# Altium schematic sheet Sec_Controller_Sheet3.SchDoc
size 420 x 297 mm; SheetNumber: 22; SheetTotal: 32
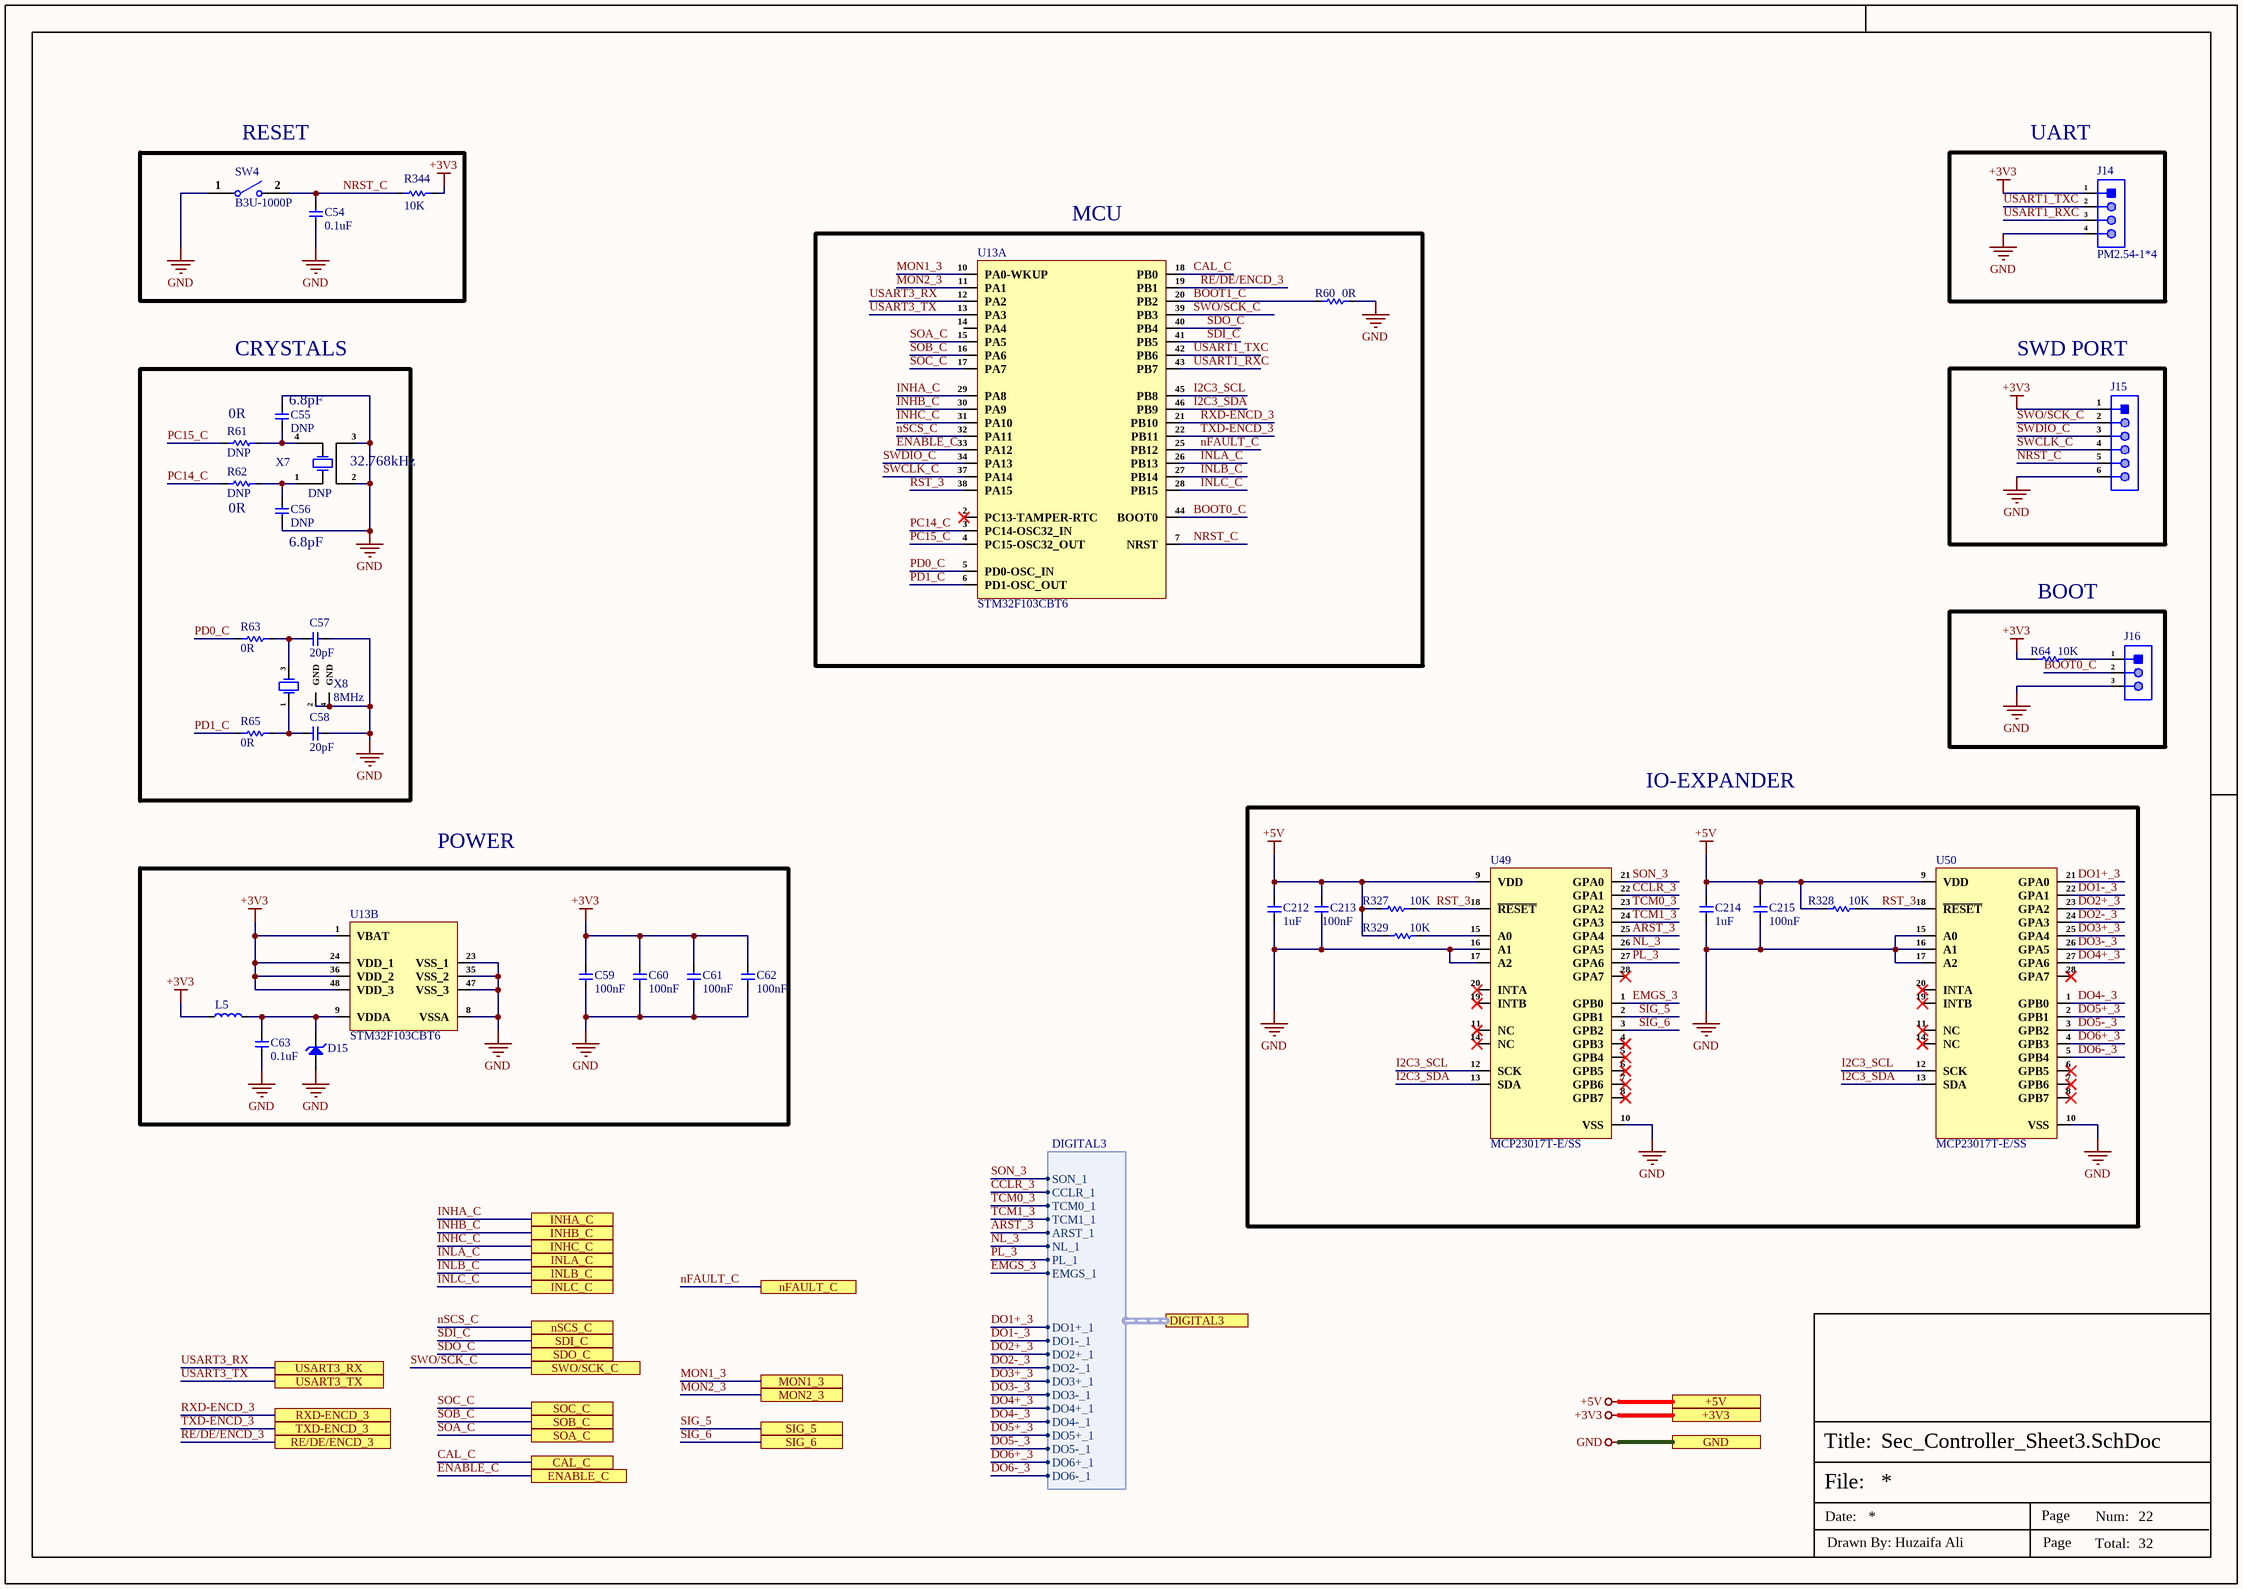
[diagram p0: Sec_Controller_Sheet3.SchDoc]

## Parts
C54  0.1uF  [Cap-0402]
C55  DNP  [Cap-0402]
C56  DNP  [Cap-0402]
C57  20pF  [Cap-0402]
C58  20pF  [Cap-0402]
C59  100nF  [cap-0402]
C60  100nF  [cap-0402]
C61  100nF  [cap-0402]
C62  100nF  [cap-0402]
C63  0.1uF  [Cap-0402]
C212  1uF  [Cap-0402]
C213  100nF  [cap-0402]
C214  1uF  [Cap-0402]
C215  100nF  [cap-0402]
D15  AZ3003-01G  [SOD-123]  (value not drawn)
J14  PM2.54-1*4  [HDR1X4 Female]
J15  X6511WV-06H-C60D30  [HDR1X6_]  (value not drawn)
J16  68000-103HLF  [HDR1X3_]  (value not drawn)
L5  BLM15AG601SN1D  [IND-0402]  (value not drawn)
R60  0R  [Res-0402]
R61  DNP  [Res-0603]
R62  DNP  [Res-0603]
R63  0R  [Res-0603]
R64  10K  [Res-0402]
R65  0R  [Res-0603]
R327  10K  [Res-0402]
R328  10K  [Res-0402]
R329  10K  [Res-0402]
R344  10K  [Res-0402]
SW4  B3U-1000P  [B3U-1000P]
U13  STM32F103CBT6  [48-LQFP (7x7)_]  (parts A,B of 2)
U49  MCP23017T-E/SS  [SSOP-28-208mil]
U50  MCP23017T-E/SS  [SSOP-28-208mil]
X7  DNP  [MC-306]
X8  8MHz  [5TJ480000XYLBC_]

## Blocks framed on the sheet
RESET: C54 R344 SW4
UART: J14
MCU: R60 U13
CRYSTALS: C55-C58 R61-R63 R65 X7 X8
SWD PORT: J15
BOOT: J16 R64
IO-EXPANDER: C212-C215 R327-R329 U49 U50
POWER: C59-C63 D15 L5 U13

## Ports
+3V3 (see Servo3[2A], CAN_Sheet[5D], Connector_Sheet[5D], Controller_Sheet[5D], Encoder_Sheet1[5D], Encoder_Sheet2[5D], Encoder_Sheet3[5D], Encoder_Sheet4[5D], EtherCAT_Sheet[5D], Motor_Driver_Sheet1[5D], Motor_Driver_Sheet2[5D], Motor_Driver_Sheet3[5D], Motor_Driver_Sheet4[5D], Power_Sheet[5D], RJ45_Sheet[5D], RS485_RS232_Sheet[3D], Sec_Controller_Sheet1[5D], Sec_Controller_Sheet2[5D], Sec_Controller_Sheet4[5D]), +5V, CAL_C (see Servo3[2B], Motor_Driver_Sheet3[3D]), DIGITAL3 (harness DIGITAL3, see Servo3[2B], DIO_3[4D]), ENABLE_C (see Servo3[2B], Motor_Driver_Sheet3[3D]), GND (see Servo3[2B], CAN_Sheet[5D], Connector_Sheet[5D], Controller_Sheet[5D], DIO_1[5D], DIO_2[5D], DIO_3[5D], DIO_4[5D], Encoder_Sheet1[5D], Encoder_Sheet2[5D], Encoder_Sheet3[5D], Encoder_Sheet4[5D], EtherCAT_Sheet[5D], MOSFET_Driver_Sheet1[5D], MOSFET_Driver_Sheet2[5D], MOSFET_Driver_Sheet3[5D], MOSFET_Driver_Sheet4[5D], Motor_Driver_Sheet1[5D], Motor_Driver_Sheet2[5D], Motor_Driver_Sheet3[5D], Motor_Driver_Sheet4[5D], Power_Sheet[5D], RJ45_Sheet[5D], RS485_RS232_Sheet[3D], Sec_Controller_Sheet1[5D], Sec_Controller_Sheet2[5D], Sec_Controller_Sheet4[5D]), INHA_C (see Servo3[2B], Motor_Driver_Sheet3[3D]), INHB_C (see Servo3[2B], Motor_Driver_Sheet3[3D]), INHC_C (see Servo3[2B], Motor_Driver_Sheet3[3D]), INLA_C (see Servo3[2B], Motor_Driver_Sheet3[3D]), INLB_C (see Servo3[2B], Motor_Driver_Sheet3[3D]), INLC_C (see Servo3[2B], Motor_Driver_Sheet3[3D]), MON1_3 (see Servo3[2B], DIO_3[3D]), MON2_3 (see Servo3[2B], DIO_3[3D]), nFAULT_C (see Servo3[2B], Motor_Driver_Sheet3[3D]), nSCS_C (see Servo3[2B], Motor_Driver_Sheet3[3D]), RE/DE/ENCD_3 (see Servo3[2B], Encoder_Sheet3[3D]), RXD-ENCD_3 (see Servo3[2B], Encoder_Sheet3[3D]), SDI_C (see Servo3[2B], Motor_Driver_Sheet3[3D]), SDO_C (see Servo3[2B], Motor_Driver_Sheet3[3D]), SIG_5 (see Servo3[2B], DIO_3[2D]), SIG_6 (see Servo3[2B], DIO_3[2D]), SOA_C (see Servo3[2B], Motor_Driver_Sheet3[3D]), SOB_C (see Servo3[2B], Motor_Driver_Sheet3[3D]), SOC_C (see Servo3[2B], Motor_Driver_Sheet3[3D]), SWO/SCK_C (see Servo3[2B], Motor_Driver_Sheet3[3D]), TXD-ENCD_3 (see Servo3[2B], Encoder_Sheet3[3D]), USART3_RX (see Servo3[2B], Controller_Sheet[2D], Servo3[1B]), USART3_TX (see Servo3[2B], Controller_Sheet[2D], Servo3[1B])

## Harnesses
DIGITAL3: SON_1, TCM0_1, CCLR_1, TCM1_1, ARST_1, NL_1, PL_1, EMGS_1, DO1+_1, DO1-_1, DO2+_1, DO2-_1, DO3+_1, DO3-_1, DO4+_1, DO4-_1, DO5+_1, DO5-_1, DO6+_1, DO6-_1

## Nets
+3V3: C59.2 C60.2 C61.2 C62.2 J14.1 J15.1 L5.1 R64.2 R344.2 U13.1(VBAT) U13.24(VDD_1) U13.36(VDD_2) U13.48(VDD_3) ; port +3V3
+5V: C212.2 C213.2 C214.2 C215.2 R327.2 R328.2 R329.2 U49.9(VDD) U50.9(VDD) ; port +5V
GND: C54.1 C55.2 C56.1 C57.2 C58.2 C59.1 C60.1 C61.1 C62.1 C63.1 C212.1 C213.1 C214.1 C215.1 D15.1(A) J14.4 J15.6 J16.3 R60.2 SW4.1 U13.8(VSSA) U13.23(VSS_1) U13.35(VSS_2) U13.47(VSS_3) U49.10(VSS) U49.16(A1) U49.17(A2) U50.10(VSS) U50.15(A0) U50.16(A1) U50.17(A2) X7.2 X7.3 X8.2(GND) X8.4(GND) ; port GND
ARST_3: U49.25(GPA4) ; port DIGITAL3.ARST_1
BOOT0_C: J16.2 U13.44(BOOT0)
BOOT1_C: R60.1 U13.20(PB2)
CAL_C: U13.18(PB0) ; port CAL_C
CCLR_3: U49.22(GPA1) ; port DIGITAL3.CCLR_1
DO1+_3: U50.21(GPA0) ; port DIGITAL3.DO1+_1
DO1-_3: U50.22(GPA1) ; port DIGITAL3.DO1-_1
DO2+_3: U50.23(GPA2) ; port DIGITAL3.DO2+_1
DO2-_3: U50.24(GPA3) ; port DIGITAL3.DO2-_1
DO3+_3: U50.25(GPA4) ; port DIGITAL3.DO3+_1
DO3-_3: U50.26(GPA5) ; port DIGITAL3.DO3-_1
DO4+_3: U50.27(GPA6) ; port DIGITAL3.DO4+_1
DO4-_3: U50.1(GPB0) ; port DIGITAL3.DO4-_1
DO5+_3: U50.2(GPB1) ; port DIGITAL3.DO5+_1
DO5-_3: U50.3(GPB2) ; port DIGITAL3.DO5-_1
DO6+_3: U50.4(GPB3) ; port DIGITAL3.DO6+_1
DO6-_3: U50.5(GPB4) ; port DIGITAL3.DO6-_1
EMGS_3: U49.1(GPB0) ; port DIGITAL3.EMGS_1
ENABLE_C: U13.33(PA12) ; port ENABLE_C
I2C3_SCL: U13.45(PB8) U49.12(SCK) U50.12(SCK)
I2C3_SDA: U13.46(PB9) U49.13(SDA) U50.13(SDA)
INHA_C: U13.29(PA8) ; port INHA_C
INHB_C: U13.30(PA9) ; port INHB_C
INHC_C: U13.31(PA10) ; port INHC_C
INLA_C: U13.26(PB13) ; port INLA_C
INLB_C: U13.27(PB14) ; port INLB_C
INLC_C: U13.28(PB15) ; port INLC_C
MON1_3: U13.10(PA0-WKUP) ; port MON1_3
MON2_3: U13.11(PA1) ; port MON2_3
nFAULT_C: U13.25(PB12) ; port nFAULT_C
NL_3: U49.26(GPA5) ; port DIGITAL3.NL_1
NRST_C: C54.2 J15.5 R344.1 SW4.2 U13.7(NRST)
nSCS_C: U13.32(PA11) ; port nSCS_C
PC14_C: R62.2 U13.3(PC14-OSC32_IN)
PC15_C: R61.2 U13.4(PC15-OSC32_OUT)
PD0_C: R63.2 U13.5(PD0-OSC_IN)
PD1_C: R65.2 U13.6(PD1-OSC_OUT)
PL_3: U49.27(GPA6) ; port DIGITAL3.PL_1
RE/DE/ENCD_3: U13.19(PB1) ; port RE/DE/ENCD_3
RST_3: R327.1 R328.1 U13.38(PA15) U49.18(~{RESET}) U50.18(~{RESET})
RXD-ENCD_3: U13.21(PB10) ; port RXD-ENCD_3
SDI_C: U13.41(PB5) ; port SDI_C
SDO_C: U13.40(PB4) ; port SDO_C
SIG_5: U49.2(GPB1) ; port SIG_5
SIG_6: U49.3(GPB2) ; port SIG_6
SOA_C: U13.15(PA5) ; port SOA_C
SOB_C: U13.16(PA6) ; port SOB_C
SOC_C: U13.17(PA7) ; port SOC_C
SON_3: U49.21(GPA0) ; port DIGITAL3.SON_1
SWCLK_C: J15.4 U13.37(PA14)
SWDIO_C: J15.3 U13.34(PA13)
SWO/SCK_C: J15.2 U13.39(PB3) ; port SWO/SCK_C
TCM0_3: U49.23(GPA2) ; port DIGITAL3.TCM0_1
TCM1_3: U49.24(GPA3) ; port DIGITAL3.TCM1_1
TXD-ENCD_3: U13.22(PB11) ; port TXD-ENCD_3
USART1_RXC: J14.3 U13.43(PB7)
USART1_TXC: J14.2 U13.42(PB6)
USART3_RX: U13.12(PA2) ; port USART3_RX
USART3_TX: U13.13(PA3) ; port USART3_TX
NetC55_1: C55.1 R61.1 X7.4(OSC2)
NetC56_2: C56.2 R62.1 X7.1(OSC1)
NetC57_1: C57.1 R63.1 X8.3(OSC2)
NetC58_1: C58.1 R65.1 X8.1(OSC1)
NetC63_2: C63.2 D15.2(K) L5.2 U13.9(VDDA)
NetJ16_1: J16.1 R64.1
NetR329_1: R329.1 U49.15(A0)

Not connected (* = marked no-connect by the designer): U13 2(PC13-TAMPER-RTC)* 14(PA4); U49 4(GPB3)* 5(GPB4)* 6(GPB5)* 7(GPB6)* 8(GPB7)* 11(NC)* 14(NC)* 19(INTB)* 20(INTA)* 28(GPA7)*; U50 6(GPB5)* 7(GPB6)* 8(GPB7)* 11(NC)* 14(NC)* 19(INTB)* 20(INTA)* 28(GPA7)*

## Notes on the sheet
- (near R61) 0R
- (near C55) 6.8pF
- (near R62) 0R
- (near X7) 32.768kHz
- (near C56) 6.8pF
- File:
- Title:
- Date:
- Page
- Num:
- Total:
- Drawn By: Huzaifa Ali

## Library data of the parts
C54 C63 = CC0402JRX7R7BB104: CAP CER 0.1UF 16V X7R 0402; Manufacturer: Yageo; Material: 4241ConductorMaterial; Value: 100nF; Tolerance: 5%; Item Type: Capacitor; Supplier: Digikey; Supplier Part Number: 311-1676-1-ND; Manufacturer Part Number: CC0402JRX7R7BB104; RoHS: Yes; Category: Ceramic Capacitors; Stock: 1659111; Pricing: 1=0.1, 10=0.046, 50=0.0262, 100=0.0203, 500=0.01528, 1000=0.012, 2500=0.01091, 5000=0.01004 (USD); Mounting Technology: Surface Mount; Case/Package: 0402; Case Code (Metric): 1005; Case Code (Imperial): 0402; Min Operating Temperature: -55°C; Max Operating Temperature: 125°C; Dielectric: X7R; Packaging: Tape and Reel; Package Quantity: 10000; Voltage Rating (DC): 16V; Voltage Rating: 16V; Series: CC; Construction: Flat; Length: 0.039inch; Width: 0.02inch; Height: 0.5mm; Thickness: 0.022inch; Lead Free: Lead Free; Halogen Free: Halogen Free; RoHS Compliant: Yes; ComponentLink1URL: https://datasheet.ciiva.com/13210/upy-gphc-x7r-6-3v-to-50v-8-12304-13210152.pdf?src-supplier=Mouser; ComponentLink1Description: https://datasheet.ciiva.com/13210/upy-gphc-x7r-6-3v-to-50v-8-12304-13210152.pdf?src-supplier=Mouser; LCSC Part Number: C541464
C55 C56 = CC0402CRNPO9BN6R8: CAP CER 6.8PF 50V C0G/NPO 0402; Manufacturer: Yageo; Dielectric: C0G; Tolerance: 2%; Insulation Resistance: 10GR; Item Type: Capacitor; Supplier: Future Electronics; Supplier Part Number: 3247368; Manufacturer Part Number: CC0402CRNPO9BN6R8; RoHS: Yes; Category: Ceramic Capacitors; Stock: 200000; Pricing: 10000=0.0024, 40000=0.0022, 150000=0.0021, 400000=0.002, 1000000=0.0019 (USD); Mounting Technology: Surface Mount; Case/Package: 0402; Case Code (Imperial): 0402; Case Code (Metric): 1005; Weight: 2.3E-05oz; Min Operating Temperature: -55°C; Max Operating Temperature: 125°C; Value: 6.8pF; Packaging: Tape and Reel; Voltage Rating: 50V; Voltage Rating (DC): 50V; Termination: SMD/SMT; Series: CC; Construction: Flat; Length: 1mm; Width: 0.5mm; Height: 0.5mm; Depth: 0.5mm; Radiation Hardening: No; RoHS Compliant: Yes; ComponentLink1URL: https://datasheet.ciiva.com/11587/upy-gp-np0-16v-to-50v-8-11587182.pdf?src-supplier=Avnet; ComponentLink1Description: https://datasheet.ciiva.com/11587/upy-gp-np0-16v-to-50v-8-11587182.pdf?src-supplier=Avnet; LCSC Part Number: C189470
C57 C58 = CC0402JRNPO9BN200: CAP CER 20PF 50V C0G/NPO 0402; Manufacturer: Yageo; Item Type: Capacitor; Temperature Coefficient: 30ppm/°C; Supplier: Avnet; LCSC Part Number: C107000; Manufacturer Part Number: CC0402JRNPO9BN200; RoHS: Yes; Stock: 20000; Pricing: 10000=0.00221 (USD); Halogen Free: 5694HalogenFree; ComponentLink1URL: https://datasheet.ciiva.com/176/mlccorderingcode-176360.pdf?src-supplier=Digikey; ComponentLink1Description: https://datasheet.ciiva.com/176/mlccorderingcode-176360.pdf?src-supplier=Digikey; ComponentLink2URL: https://datasheet.ciiva.com/176/mlccorderingcode-176361.pdf?src-supplier=Digikey; ComponentLink2Description: https://datasheet.ciiva.com/176/mlccorderingcode-176361.pdf?src-supplier=Digikey; ComponentLink3URL: https://datasheet.ciiva.com/176/mlccorderingcode-176362.pdf?src-supplier=Digikey; ComponentLink3Description: https://datasheet.ciiva.com/176/mlccorderingcode-176362.pdf?src-supplier=Digikey; ComponentLink4URL: https://datasheet.ciiva.com/7656/1132289-7656614.pdf?src-supplier=Element14; ComponentLink4Description: https://datasheet.ciiva.com/7656/1132289-7656614.pdf?src-supplier=Element14; ComponentLink5URL: https://datasheet.ciiva.com/5427/upy-gp-np0-16v-to-50v-8-3714-5427769.pdf?src-supplier=Mouser; ComponentLink5Description: https://datasheet.ciiva.com/5427/upy-gp-np0-16v-to-50v-8-3714-5427769.pdf?src-supplier=Mouser
C59-C62 C213 C215 = C1005X7R1H104KT000F: CAP CER 0.1UF 50V X7R 0402; Manufacturer: TDK; Tolerance: 10%; Voltage: 25V; Item Type: Capacitor; Supplier 1: Avnet; Manufacturer Part Number: C1005X7R1H104KT000F; RoHS: No; Category: Ceramic Capacitors; Dielectric: X7R; Supplier Part Number 1: C1005X7R1H104KT000F; LCSC Part Number: C361198; ComponentLink1Description: LCSC; ComponentLink1URL: https://www.lcsc.com/product-detail/Multilayer-Ceramic-Capacitors-MLCC-SMD-SMT_TDK-C1005X7R1H104KT000F_C361198.html
C212 C214 = CC0402KRX5R6BB105: CAP CER 1UF 10V X5R 0402; Manufacturer: Yageo; Tolerance: 10%; Dissipation Factor: 15%; Item Type: Capacitor; Supplier 1: Mouser; Manufacturer Part Number: CC0402KRX5R6BB105; RoHS: Yes; Category: Ceramic Capacitors; Stock 1: 6711367; Pricing 1: 1=0.11000, 10=0.05500, 50=0.05500, 100=0.03300, 500=0.02700, 1000=0.02200, 2500=0.02100, 10000=0.01800 (USD); Mount: Surface Mount; Case/Package: 0402; Number of Pins: 2; Case Code (Metric): 1005; Case Code (Imperial): 0402; Min Operating Temperature: -55°C; Max Operating Temperature: 85°C; Capacitance: 1uF; Dielectric: X5R; Package Quantity: 1; Voltage Rating: 10V; Packaging: Tape and Reel; Voltage Rating (DC): 10V; Termination: SMD/SMT; Resistor Type: Ceramic; Series: CC; Construction: Flat; Length: 1mm; Width: 0.02inch; Height: 0.5mm; Thickness: 0.022inch; Depth: 0.5mm; Radiation Hardening: No; REACH SVHC: No SVHC; Lead Free: Lead Free; Halogen Free: Halogen Free; RoHS Compliant: Yes; ComponentLink1URL: https://datasheet.ciiva.com/176/upy-gphc-x5r-4v-to-50v-12-176704.pdf?src-supplier=Digi-Key; ComponentLink1Description: https://datasheet.ciiva.com/176/upy-gphc-x5r-4v-to-50v-12-176704.pdf?src-supplier=Digi-Key; ComponentLink2URL: https://datasheet.ciiva.com/176/mlccorderingcode-176705.pdf?src-supplier=Digi-Key; ComponentLink2Description: https://datasheet.ciiva.com/176/mlccorderingcode-176705.pdf?src-supplier=Digi-Key; ComponentLink3URL: https://datasheet.ciiva.com/176/mlccorderingcode-176706.pdf?src-supplier=Digi-Key; ComponentLink3Description: https://datasheet.ciiva.com/176/mlccorderingcode-176706.pdf?src-supplier=Digi-Key; Supplier Part Number 1: 603-CC402KRX5R6BB105; LCSC Part Number: C106254
D15 = AZ3003-01G: TVS SURGE PROTECTOR 1-CH 3.3V; Manufacturer: Amazing; Item Type: Diode; Manufacturer Part Number: AZ3003-01G; Package: SOD-123; LCSC Part Number: -; ComponentLink1Description: Digikey; ComponentLink1URL: https://www.digikey.com/en/products/detail/amazing/AZ3003-01G/16615352?s=N4IgTCBcDaIIIC0DMAGFSC0KCMBxEAugL5A
J14 = PM2.54-1*4: 2mm 2.54mm Plugin 2.5A -40℃~+105℃ Straight 1x4P Top 8.5mm 4 Square Hole Plugin,P=2.54mm Female Headers ROHS; Manufacturer: ZHOURI; Manufacturer Part Number: PM2.54-1*4; Package: Plugin,P=2.54mm; LCSC Part Number: C5116530; Item Type: Female Header; ComponentLink1Description: LCSC; ComponentLink1URL: https://www.lcsc.com/product-detail/span-style-background-color-ff0-Female-span-Headers_ZHOURI-PM2-54-1-4_C5116530.html
J15 = X6511WV-06H-C60D30: Gold 250V 3A Straight Square Pins 2.5mm 6P 260℃ 6mm -40℃~+105℃ 3mm 2.54mm Plugin Black Brass 1x6P Plugin,P=2.54mm Pin Headers ROHS; Manufacturer: XKB; Item Type: Male Header; Manufacturer Part Number: X6511WV-06H-C60D30; Package: Plugin,P=2.54mm; LCSC Part Number: C706878; ComponentLink1Description: LCSC; ComponentLink1URL: https://www.lcsc.com/product-detail/Pin-Headers_XKB-Connectivity-X6511WV-06H-C60D30_C706878.html
J16 = 68000-103HLF: CONN HEADER VERT 3POS 2.54MM; Item Type: Male Header; Number of Positions: 3; Current Rating: 3A; Insulation Resistance: 5GR; Voltage Rating: 1.5kV; Contact Post Length: 2.41mm; LCSC Part Number: C168677; ComponentLink1Description: LCSC; Supplier: Avnet; Supplier Part Number: 88K1775; RoHS: No; Category: Headers and Wire Housings; Stock: 2805; Pricing: 1=0.395, 10=0.31, 25=0.29, 50=0.27, 100=0.25 (USD); Contact Plating: Gold,GXT; Contact Material: Bronze; Housing Material: Thermoplastic; Housing Color: Black; Min Operating Temperature: -65°C; Max Operating Temperature: 125°C; Number of Rows: 1; Termination: Through Hole; Packaging: Bulk; Number of Contacts: 3; Contact Gender: Male; Orientation: Straight; Max Voltage Rating (AC): 1.5kV; Package Quantity: 100; Series: 68000; Length: 7.62mm; Pitch: 2.54mm; Contact Mating Length: 5.84mm; Depth: 2.41mm; Radiation Hardening: No; Flammability Rating: UL94 V-0; Reach SVHC Compliant: No; ComponentLink2URL: https://datasheet.ciiva.com/46392/1914865-46392021.pdf?src-supplier=Element14; ComponentLink2Description: https://datasheet.ciiva.com/46392/1914865-46392021.pdf?src-supplier=Element14
L5 = BLM15AG601SN1D: FERRITE BEAD 600 OHM 0402 1LN; Manufacturer: Murata; Material: Steel,Ferrite; Impedance: 600R; Tolerance: 25%; Max DC Current: 300mA; DC Resistance (DCR): 520mR; Test Frequency: 100MHz; Number of Lines: 1; Shielding: Unshielded; DC Resistance-Max: 600mR; Supplier 1: Digi-Key; Manufacturer Part Number: BLM15AG601SN1D; RoHS: Yes; Category: Inductors; Stock 1: 4108655; Pricing 1: 1=0.10000, 10=0.06500, 25=0.05760, 50=0.05240, 100=0.04710, 250=0.03456, 500=0.02514, 1000=0.02461, 5000=0.01676 (USD); Case/Package: 0402; Number of Pins: 2; Core Material: Ferrite; Case Code (Metric): 1005; Case Code (Imperial): 0402; Min Operating Temperature: -55°C; Max Operating Temperature: 125°C; Package Quantity: 10000; Packaging: Tape and Reel; Current Rating: 300mA; Max Current Rating: 300mA; Termination: SMD/SMT; DC Current: 300mA; Frequency: 100MHz; Number of Circuits: 1; Series: BLM15AG_SN; Length: 1mm; Width: 0.5mm; Height: 0.5mm; Depth: 0.55mm; Radiation Hardening: No; REACH SVHC: No SVHC; Military Standard: Not; Lead Free: Lead Free; RoHS Compliant: Yes; ComponentLink1URL: https://datasheet.ciiva.com/11799/0900766b811b5866-11799226.pdf?src-supplier=RSComponents; ComponentLink1Description: https://datasheet.ciiva.com/11799/0900766b811b5866-11799226.pdf?src-supplier=RSComponents; ComponentLink2URL: https://datasheet.ciiva.com/41449/001172163-da-01-en-drossel-0402-600r-1-0x0-5mm-10000st-41449450.pdf?src-supplier=Conrad; ComponentLink2Description: https://datasheet.ciiva.com/41449/001172163-da-01-en-drossel-0402-600r-1-0x0-5mm-10000st-41449450.pdf?src-supplier=Conrad; ComponentLink3URL: https://datasheet.ciiva.com/29347/442210-da-01-en-chip-drossel-0402-600r-300ma-1-0x0-5mm-29347879.pdf?src-supplier=Conrad; ComponentLink3Description: https://datasheet.ciiva.com/29347/442210-da-01-en-chip-drossel-0402-600r-300ma-1-0x0-5mm-29347879.pdf?src-supplier=Conrad; ComponentLink4URL: https://datasheet.ciiva.com/1466/5144-1466744.pdf?src-supplier=Element14; ComponentLink4Description: https://datasheet.ciiva.com/1466/5144-1466744.pdf?src-supplier=Element14; ComponentLink5URL: https://datasheet.ciiva.com/1466/5144-1466745.pdf?src-supplier=Element14; ComponentLink5Description: https://datasheet.ciiva.com/1466/5144-1466745.pdf?src-supplier=Element14; ComponentLink6URL: https://datasheet.ciiva.com/14122/blm-series-eng-tds-14122894.pdf?src-supplier=Distrelec; ComponentLink6Description: https://datasheet.ciiva.com/14122/blm-series-eng-tds-14122894.pdf?src-supplier=Distrelec; ComponentLink7URL: https://datasheet.ciiva.com/6212/l0110s0100blm15ag-sn-6212519.pdf?src-supplier=Digi-Key; ComponentLink7Description: https://datasheet.ciiva.com/6212/l0110s0100blm15ag-sn-6212519.pdf?src-supplier=Digi-Key; ComponentLink8URL: https://datasheet.ciiva.com/6212/l0110s0100blm15ag-sn-6212565.pdf?src-supplier=Digi-Key; ComponentLink8Description: https://datasheet.ciiva.com/6212/l0110s0100blm15ag-sn-6212565.pdf?src-supplier=Digi-Key; ComponentLink9URL: https://datasheet.ciiva.com/6212/l0110s0100blm15ag-sn-6212520.pdf?src-supplier=Digi-Key; ComponentLink9Description: https://datasheet.ciiva.com/6212/l0110s0100blm15ag-sn-6212520.pdf?src-supplier=Digi-Key; ComponentLink10URL: https://datasheet.ciiva.com/8084/l0110s0100blm15ag-sn-8084271.pdf?src-supplier=Avnet; ComponentLink10Description: https://datasheet.ciiva.com/8084/l0110s0100blm15ag-sn-8084271.pdf?src-supplier=Avnet; ComponentLink11URL: https://datasheet.ciiva.com/8510/l0110s0100blm15ag-sn-8510909.pdf?src-supplier=Avnet; ComponentLink11Description: https://datasheet.ciiva.com/8510/l0110s0100blm15ag-sn-8510909.pdf?src-supplier=Avnet; Supplier Part Number 1: 490-1006-1-ND; LCSC Part Number: C76884; Item Type: Ferrite Bead
R60 = RC0402FR-070RL: RES 0 OHM JUMPER 1/16W 0402; Manufacturer: Yageo; Item Type: Resistors; Tolerance: 1%; Power Rating: 62.5mW; Voltage Rating: 50V; Temperature Coefficient: 200ppm/°C; Max Power Dissipation: 63mW; Supplier 1: Mouser; Manufacturer Part Number: RC0402FR-070RL; RoHS: Yes; Stock 1: 8556842; Pricing 1: 1=0.10000, 10=0.01400, 50=0.01400, 100=0.00600, 1000=0.00300, 5000=0.00200, 10000=0.00100 (USD); Mount: Surface Mount; Case/Package: 0402; Contact Plating: Tin,Matte; Case Code (Imperial): 0402; Case Code (Metric): 1005; Size Code: 0402; Min Operating Temperature: -55°C; Max Operating Temperature: 155°C; Resistance: 0R; Resistor Type: Thick Film; Packaging: Tape and Reel; Termination: SMD/SMT; Features: Moisture Resistant; Series: RC; Number of Terminations: 2; Length: 1mm; Width: 0.5mm; Height: 0.35mm; Radiation Hardening: No; Lead Free: Lead Free; RoHS Compliant: Yes; ComponentLink1URL: https://datasheet.ciiva.com/8896/pyu-rc0402-51-rohs-l-6-8896149.pdf?src-supplier=Avnet; ComponentLink1Description: https://datasheet.ciiva.com/8896/pyu-rc0402-51-rohs-l-6-8896149.pdf?src-supplier=Avnet; ComponentLink2URL: https://datasheet.ciiva.com/16790/pyu-rc0402-51-rohs-l-6-r-16790444.pdf?src-supplier=Future+Electronics; ComponentLink2Description: https://datasheet.ciiva.com/16790/pyu-rc0402-51-rohs-l-6-r-16790444.pdf?src-supplier=Future+Electronics; Supplier Part Number 1: 603-RC0402FR-070RL; LCSC Part Number: C106231
R61-R63 R65 = RC0603JR-070RL: RES 0 OHM JUMPER 1/10W 0603; Manufacturer: Yageo; Resistance: 0mR; Tolerance: 1%; Power Rating: 100mW; Voltage Rating (DC): 50V; Temperature Coefficient: 200ppm/°C; Resistance Tolerance: 5%; Item Type: Resistor; Supplier 1: Digi-Key; Manufacturer Part Number: RC0603JR-070RL; RoHS: Yes; Category: Chip SMD Resistors; Stock 1: 18081776; Pricing 1: 1=0.10000, 10=0.01700, 25=0.01240, 50=0.00960, 100=0.00700, 250=0.00536, 500=0.00430, 1000=0.00316 (USD); Case/Package: 0603; Number of Pins: 2; Contact Plating: Tin,Matte; Case Code (Imperial): 0603; Case Code (Metric): 1608; Size Code: 0603; Min Operating Temperature: -55°C; Max Operating Temperature: 155°C; Resistor Type: Thick Film; Packaging: Tape and Reel; Termination: SMD/SMT; Series: RC; Technology: THICK FILM; Package Quantity: 5000; Voltage Rating: 50V; Features: Moisture Resistant; Max Power Dissipation: 100mW; Number of Terminations: 2; Construction: Rectangular; Length: 1.6mm; Width: 0.8mm; Height: 0.45mm; Depth: 0.8mm; Radiation Hardening: No; Reach SVHC Compliant: No SVHC; Lead Free: Lead Free; RoHS Compliant: Yes; Military Standard: Not; Supplier Part Number 1: 311-0.0GRCT-ND; LCSC Part Number: C95177
R64 R327-R329 R344 = RC0402FR-0710KL: RES 10K OHM 1% 1/16W 0402; Manufacturer: Yageo; Resistance: 10kR; Voltage Rating (DC): 50V; Temperature Coefficient: 100ppm/°C; Power Rating: 62.5mW; Max Power Dissipation: 63mW; Item Type: Resistor; Supplier 1: Mouser; Manufacturer Part Number: RC0402FR-0710KL; RoHS: Yes; Category: Chip SMD Resistors; Stock 1: 18648329; Pricing 1: 1=0.10000, 10=0.01400, 50=0.01400, 100=0.00500, 1000=0.00300, 10000=0.00200 (USD); Case/Package: 0402; Number of Pins: 2; Case Code (Imperial): 0402; Case Code (Metric): 1005; Min Operating Temperature: -55°C; Max Operating Temperature: 155°C; Resistor Type: Thick Film; Tolerance: 1%; Packaging: Tape and Reel; Voltage Rating: 50V; Termination: SMD/SMT; Working Voltage: 50V; Number of Terminations: 2; Features: Moisture Resistant; Series: RC; Resistance Tolerance: 1%; Construction: Rectangular; Length: 1mm; Width: 0.5mm; Height: 0.32mm; Depth: 0.5mm; Lead Pitch: 0.2mm; REACH SVHC: No SVHC; Lead Free: Lead Free; RoHS Compliant: Yes; Military Standard: Not; ComponentLink1URL: https://datasheet.ciiva.com/7660/38568-7660787.pdf?src-supplier=Element14; ComponentLink1Description: https://datasheet.ciiva.com/7660/38568-7660787.pdf?src-supplier=Element14; ComponentLink2URL: https://datasheet.ciiva.com/7849/1686128-7849814.pdf?src-supplier=Element14; ComponentLink2Description: https://datasheet.ciiva.com/7849/1686128-7849814.pdf?src-supplier=Element14; ComponentLink3URL: https://datasheet.ciiva.com/7983/1018594-7983486.pdf?src-supplier=Element14; ComponentLink3Description: https://datasheet.ciiva.com/7983/1018594-7983486.pdf?src-supplier=Element14; ComponentLink4URL: https://datasheet.ciiva.com/22747/1018594-22747512.pdf?src-supplier=Element14; ComponentLink4Description: https://datasheet.ciiva.com/22747/1018594-22747512.pdf?src-supplier=Element14; ComponentLink5URL: https://datasheet.ciiva.com/12667/pyu-rc0402-51-rohs-l-6-r-12667067.pdf?src-supplier=Mouser; ComponentLink5Description: https://datasheet.ciiva.com/12667/pyu-rc0402-51-rohs-l-6-r-12667067.pdf?src-supplier=Mouser; ComponentLink6URL: https://datasheet.ciiva.com/7849/1784430-7849813.pdf?src-supplier=Element14; ComponentLink6Description: https://datasheet.ciiva.com/7849/1784430-7849813.pdf?src-supplier=Element14; ComponentLink7URL: https://datasheet.ciiva.com/7849/1784430-7849815.pdf?src-supplier=Element14; ComponentLink7Description: https://datasheet.ciiva.com/7849/1784430-7849815.pdf?src-supplier=Element14; Supplier Part Number 1: 603-RC0402FR-0710KL; LCSC Part Number: C60490
SW4 = B3U-1000P: SWITCH TACTILE SPST-NO 0.05A 12V; Manufacturer: Omron; Mechanical Life: 200000Cycles; Operating Force: 1.5N; Throw Configuration: SPST; Current Rating: 50mA; Contact Resistance: 100mR; Illumination Type: Non-Illuminated,Illuminated; Switch Travel: 0.15mm; Switch Function: Off-Mom; Actuator Type: Standard; Actuator Length: 0.4mm; Ratings: Dust Proof,IP40; ComponentLink1URL: http://www.farnell.com/datasheets/60838.pdf?src-supplier=Farnell; ComponentLink1Description: http://www.farnell.com/datasheets/60838.pdf?src-supplier=Farnell; ComponentLink2URL: http://www.farnell.com/datasheets/60838.pdf?src-supplier=Element14; ComponentLink2Description: http://www.farnell.com/datasheets/60838.pdf?src-supplier=Element14; ComponentLink3URL: https://omronfs.omron.com/en_US/ecb/products/pdf/en-b3u.pdf?src-supplier=Digi-Key; ComponentLink3Description: https://omronfs.omron.com/en_US/ecb/products/pdf/en-b3u.pdf?src-supplier=Digi-Key; ComponentLink4URL: http://www.omron.com/ecb/products/pdf/en-b3u.pdf?src-supplier=Digi-Key; ComponentLink4Description: http://www.omron.com/ecb/products/pdf/en-b3u.pdf?src-supplier=Digi-Key; ComponentLink5URL: https://www.distrelec.biz/Web/Downloads/he/et/B3U_eng_datasheet.pdf?mime=application%2Fpdf&src-supplier=Distrelec; ComponentLink5Description: https://www.distrelec.biz/Web/Downloads/he/et/B3U_eng_datasheet.pdf?mime=application%2Fpdf&src-supplier=Distrelec; ComponentLink6URL: http://www.onlinecomponents.com/productFiles/mf-OM/en-b3u.pdf?src-supplier=Onlinecomponents.com; ComponentLink6Description: http://www.onlinecomponents.com/productFiles/mf-OM/en-b3u.pdf?src-supplier=Onlinecomponents.com; Supplier 1: Digi-Key; Manufacturer Part Number: B3U-1000P; Stock 1: 116454; Pricing 1: 1=1, 10=0.961, 25=0.9064, 50=0.7976, 100=0.7251, 250=0.68888, 500=0.67074, 1000=0.52571 (USD); Mount: Surface Mount; Weight: 0.000776oz; Contact Material: Silver; Min Operating Temperature: -25°C; Max Operating Temperature: 70°C; Packaging: Tape and Reel; Voltage Rating (DC): 12V; Package Quantity: 1; Max Current Rating: 50mA; Termination: SMD/SMT; Orientation: Straight; Max Voltage Rating (DC): 12V; Electrical Life: 200000Cycles; Insulation Resistance: 100MR; Contact Current Rating: 50mA; Length: 4mm; Height: 1.2mm; Depth: 2.5mm; Width: 3mm; REACH SVHC: Unknown; Lead Free: Lead Free; ComponentLink7URL: https://www.verical.com/server-webapp/html/getDatasheet?partID=552554&src-supplier=Verical; ComponentLink7Description: https://www.verical.com/server-webapp/html/getDatasheet?partID=552554&src-supplier=Verical; ComponentLink8URL: http://www.farnell.com/datasheets/1685550.pdf?src-supplier=Element14; ComponentLink8Description: http://www.farnell.com/datasheets/1685550.pdf?src-supplier=Element14; ComponentLink9URL: http://www.farnell.com/datasheets/2610940.pdf?src-supplier=Farnell; ComponentLink9Description: http://www.farnell.com/datasheets/2610940.pdf?src-supplier=Farnell; ComponentLink10URL: https://www.alliedelec.com/m/d/4c8a9ef82804fc3c241a13c1e298fd73.pdf?src-supplier=Allied+Electronics; ComponentLink10Description: https://www.alliedelec.com/m/d/4c8a9ef82804fc3c241a13c1e298fd73.pdf?src-supplier=Allied+Electronics; Supplier Part Number 1: SW1020DKR-ND; LCSC Part Number: C231329; Item Type: Switch
U13 = STM32F103CBT6: IC MCU 32BIT 128KB FLASH 48LQFP; Manufacturer: STMicroelectronics; RAM Size: 20KB; Max Power Dissipation: 363mW; Interface: I2C,SPI,USB,CAN,IrDA,UART,USART,LIN; Number of I/Os: 37; Number of Timers/Counters: 4; Max Supply Voltage: 3.6V; Number of PWM Channels: 12; Frequency: 72MHz; Number of ADC Channels: 10; Min Supply Voltage: 2V; Oscillator Type: Internal; Data Bus Width: 32b; Number of Bits: 32; Number of SPI Channels: 2; Watchdog Timer: Yes; Peripherals: POR,PWM,WDT,DMA,Temp Sensor,I2C; Core Architecture: ARM; Supplier: Mouser; Supplier Part Number: 511-STM32F103CBT6; Manufacturer Part Number: STM32F103CBT6; RoHS: Yes; Category: Microcontrollers; Stock: 3552; Pricing: 1=7.35, 10=6.65, 50=5.53, 100=5.49, 1000=4.31, 10000=4.25 (USD); Case/Package: LQFP; Pins: 48; Min Operating Temperature: -40°C; Max Operating Temperature: 85°C; Package Quantity: 250; Density: 128KB; Packaging: Tray; Number of Programmable I/O: 37; Clock Frequency: 72MHz; Number of I2C Channels: 2; Memory Format: FLASH; Termination: SMD/SMT; Address Bus Width: 32b; Memory Size: 128KB; Series: STM32 F1; Length: 7mm; Width: 7.2mm; Height: 1.45mm; Radiation Hardening: No; Reach SVHC Compliant: No; Lead Free: Lead Free; RoHS Compliant: Yes; ComponentLink1URL: https://datasheet.ciiva.com/23669/1714663-23669200.pdf?src-supplier=Newark; ComponentLink1Description: https://datasheet.ciiva.com/23669/1714663-23669200.pdf?src-supplier=Newark; ComponentLink2URL: https://datasheet.ciiva.com/15122/getdatasheetpartid-92132-15122195.pdf?src-supplier=Verical; ComponentLink2Description: https://datasheet.ciiva.com/15122/getdatasheetpartid-92132-15122195.pdf?src-supplier=Verical; ComponentLink3URL: https://datasheet.ciiva.com/5752/cd00161566-5752838.pdf?src-supplier=Farnell; ComponentLink3Description: https://datasheet.ciiva.com/5752/cd00161566-5752838.pdf?src-supplier=Farnell; ComponentLink4URL: https://datasheet.ciiva.com/14100/pustm-arm-microcont-stm32f103-en-14100509.pdf?src-supplier=Distrelec; ComponentLink4Description: https://datasheet.ciiva.com/14100/pustm-arm-microcont-stm32f103-en-14100509.pdf?src-supplier=Distrelec; ComponentLink5URL: https://datasheet.ciiva.com/1502/cd00161566-1502328.pdf?src-supplier=Digi-Key; ComponentLink5Description: https://datasheet.ciiva.com/1502/cd00161566-1502328.pdf?src-supplier=Digi-Key; ComponentLink6URL: https://datasheet.ciiva.com/4840/cd00161566-4840398.pdf?src-supplier=Mouser; ComponentLink6Description: https://datasheet.ciiva.com/4840/cd00161566-4840398.pdf?src-supplier=Mouser; ComponentLink7URL: https://datasheet.ciiva.com/16219/cd00161566-16219150.pdf?src-supplier=Future+Electronics; ComponentLink7Description: https://datasheet.ciiva.com/16219/cd00161566-16219150.pdf?src-supplier=Future+Electronics; Item Type: IC; LCSC Part Number: C8304
U49 U50 = MCP23017T-E/SS: IC XPNDR 1.7MHZ I2C 28SSOP; Manufacturer: Microchip; Operating Supply Voltage: 5.5V; Interface: I2C,Serial; Number of Channels: 1; Output Current: 25mA; Number of I/Os: 16; Power Dissipation: 700mW; Clock Frequency: 10MHz; Output Type: PUSH-PULL; Supply Current: 1mA; Supplier 1: Digi-Key; Manufacturer Part Number: MCP23017T-E/SS; RoHS: Yes; Category: Interface ICs; Stock 1: 26314; Pricing 1: 1=1.69, 25=1.4, 100=1.28 (USD); Mounting Technology: Surface Mount; Case/Package: SSOP; Pins: 28; Min Operating Temperature: -40°C; Max Operating Temperature: 125°C; Package Quantity: 2100; Series: -; Packaging: Tape and Reel; Frequency: 1.7MHz; Number of Bits: 16; Nominal Supply Voltage: 5.5V; Lead Free: Lead Free; RoHS Compliant: Yes; ComponentLink1URL: https://datasheet.ciiva.com/12267/21952b-12267583.pdf?src-supplier=Mouser; ComponentLink1Description: https://datasheet.ciiva.com/12267/21952b-12267583.pdf?src-supplier=Mouser; ComponentLink2URL: https://datasheet.ciiva.com/8128/21952b-8128586.pdf?src-supplier=Avnet; ComponentLink2Description: https://datasheet.ciiva.com/8128/21952b-8128586.pdf?src-supplier=Avnet; ComponentLink3URL: https://datasheet.ciiva.com/16454/filehandler-aspxddocname-en023709-16454267.pdf?src-supplier=Future+Electronics; ComponentLink3Description: https://datasheet.ciiva.com/16454/filehandler-aspxddocname-en023709-16454267.pdf?src-supplier=Future+Electronics; ComponentLink4URL: https://datasheet.ciiva.com/1780/21952b-1780738.pdf?src-supplier=Digi-Key; ComponentLink4Description: https://datasheet.ciiva.com/1780/21952b-1780738.pdf?src-supplier=Digi-Key; Supplier Part Number 1: MCP23017T-E/SSCT-ND; LCSC Part Number: C558584; Item Type: IC
X7 = MC-306 32.7680K-A0:ROHS: 32.768kHz 12.5pF ±20ppm MC-306 Crystals ROHS; Manufacturer: Seiko Epson; Value: 32.786kHz; Manufacturer Part Number: MC-306 32.7680K-A0:ROHS; Item Type: Crystal; LCSC Part Number: C2650464; ComponentLink1Description: LCSC; ComponentLink1URL: https://www.lcsc.com/product-detail/Crystals_Seiko-Epson-MC-306-32-7680K-A0-ROHS_C2650464.html
X8 = 5TJ480000XYLBC: 8MHz 18pF ±10ppm SMD5032-4P Crystals ROHS; Manufacturer: JYJE; Manufacturer Part Number: 5TJ480000XYLBC; ComponentLink1Description: LCSC; ComponentLink1URL: https://www.lcsc.com/product-detail/Crystals_JYJE-5TJ480000XYLBC_C2149247.html; Package: SMD5032-4P; LCSC Part Number: C2149247; Item Type: Crystal